# EAGLE design enginecontrol (EAGLE 7.6.0)
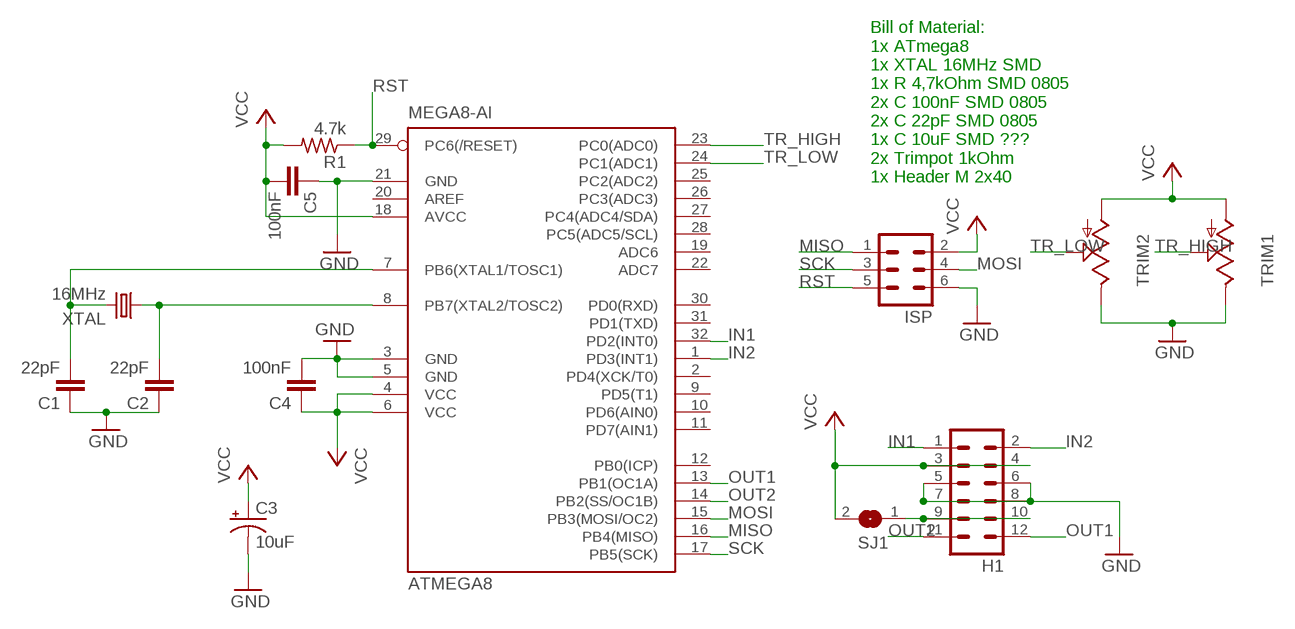
[diagram p0: schematic, sheet 1]

## Parts
ATMEGA8  MEGA8-AI  [TQFP32-08]
C1  22pF  C-EUC0805  [C0805]
C2  22pF  C-EUC0805  [C0805]
C3  10uF  CPOL-US153CLV-0605  [153CLV-0605]
C4  100nF  C-EUC0805  [C0805]
C5  100nF  C-EUC0805  [C0805]
H1  MA06-2  [MA06-2]
ISP  MA03-2  [MA03-2]
R1  4.7k  R-US_M0805  [M0805]
SJ1  SJ  [SJ]
TRIM1  TRIM_US-B25P  [B25P]
TRIM2  TRIM_US-B25P  [B25P]
XTAL  16MHz  CRYSTALSM49  [SM49]

## Nets
GND: ATMEGA8.3(GND) ATMEGA8.5(GND) ATMEGA8.21(GND) C1.1 C2.1 C3.- C4.2 C5.1 H1.5 H1.6 H1.7 H1.8 ISP.6 TRIM1.E TRIM2.E
IN1: ATMEGA8.32(PD2(INT0)) H1.1
IN2: ATMEGA8.1(PD3(INT1)) H1.2
MISO: ATMEGA8.16(PB4(MISO)) ISP.1
MOSI: ATMEGA8.15(PB3(MOSI/OC2)) ISP.4
N$1: ATMEGA8.8(PB7(XTAL2/TOSC2)) C2.2 XTAL.1
N$2: ATMEGA8.7(PB6(XTAL1/TOSC1)) C1.2 XTAL.2
N$7: H1.9 H1.10 SJ1.1
OUT1: ATMEGA8.13(PB1(OC1A)) H1.12
OUT2: ATMEGA8.14(PB2(SS/OC1B)) H1.11
RST: ATMEGA8.29(PC6(/RESET)) ISP.5 R1.1
SCK: ATMEGA8.17(PB5(SCK)) ISP.3
TR_HIGH: ATMEGA8.23(PC0(ADC0)) TRIM1.S
TR_LOW: ATMEGA8.24(PC1(ADC1)) TRIM2.S
VCC: ATMEGA8.4(VCC) ATMEGA8.6(VCC) ATMEGA8.18(AVCC) C3.+ C4.1 C5.2 H1.3 H1.4 ISP.2 R1.2 SJ1.2 TRIM1.A TRIM2.A
Unconnected: ATMEGA8.2(PD4(XCK/T0)) ATMEGA8.9(PD5(T1)) ATMEGA8.10(PD6(AIN0)) ATMEGA8.11(PD7(AIN1)) ATMEGA8.12(PB0(ICP)) ATMEGA8.19(ADC6) ATMEGA8.20(AREF) ATMEGA8.22(ADC7) ATMEGA8.25(PC2(ADC2)) ATMEGA8.26(PC3(ADC3)) ATMEGA8.27(PC4(ADC4/SDA)) ATMEGA8.28(PC5(ADC5/SCL)) ATMEGA8.30(PD0(RXD)) ATMEGA8.31(PD1(TXD))

## Notes on the sheet
- Bill of Material:
  1x ATmega8
  1x XTAL 16MHz SMD
  1x R 4,7kOhm SMD 0805
  2x C 100nF SMD 0805
  2x C 22pF SMD 0805
  1x C 10uF SMD ???
  2x Trimpot 1kOhm
  1x Header M 2x40

## Library data of the parts
ATMEGA8 = atmel:MEGA8: MICROCONTROLLER 8 Kbytes FLASH, 1 kbytes SRAM, 512 bytes EEPROM, USART, 6-channel 10 bit ADC, 2-channel 8 bit ADC Pin compatible with Atmega48, ATMega88, ATMega168 Source: avr.lbr; MPN: ATMEGA8-16AU; OC_FARNELL: 9171371; OC_NEWARK: 73M8863
C1 C2 C4 C5 = rcl:C-EU: CAPACITOR, European symbol
C3 = rcl:CPOL-US: POLARIZED CAPACITOR, American symbol
H1 = con-lstb:MA06-2: PIN HEADER; OC_FARNELL: unknown; OC_NEWARK: unknown
ISP = con-lstb:MA03-2: PIN HEADER; OC_FARNELL: unknown; OC_NEWARK: unknown
R1 = resistor:R-US_: RESISTOR, American symbol
SJ1 = jumper:SJ: SMD solder JUMPER
TRIM1 TRIM2 = pot:TRIM_US-: POTENTIOMETER
XTAL = adafruit:CRYSTAL: CRYSTAL; OC_FARNELL: unknown; OC_NEWARK: unknown

## Board
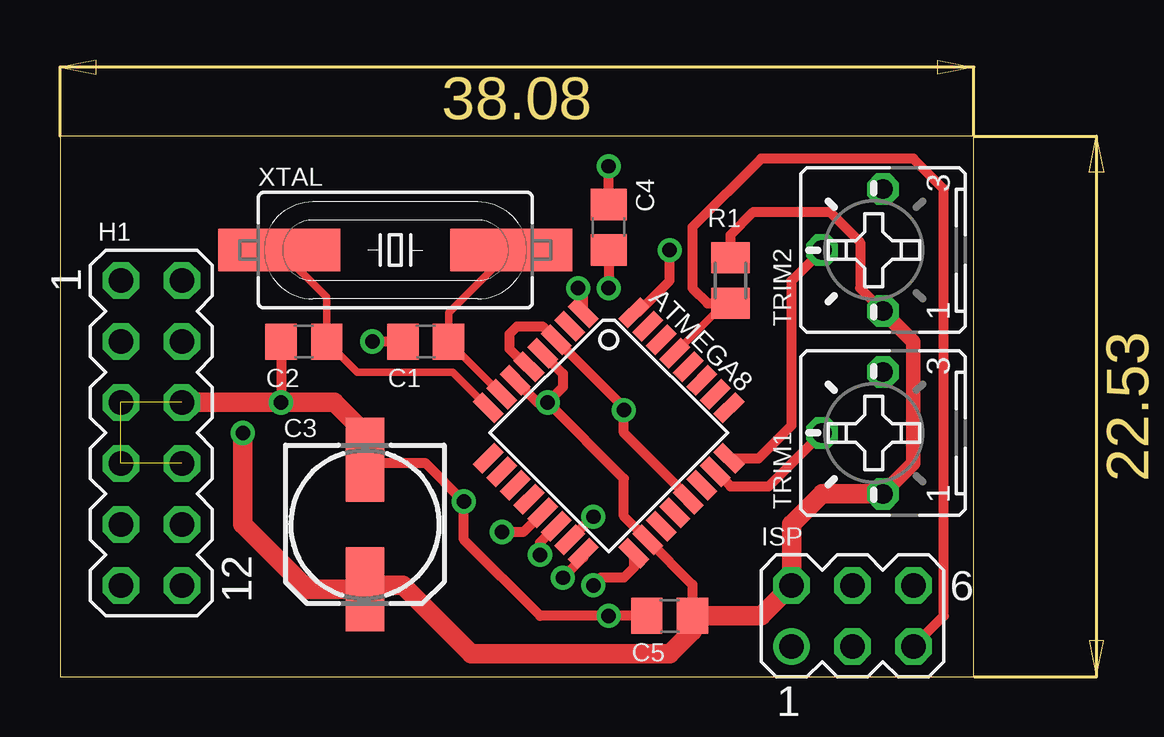
[diagram p1: board, top side]
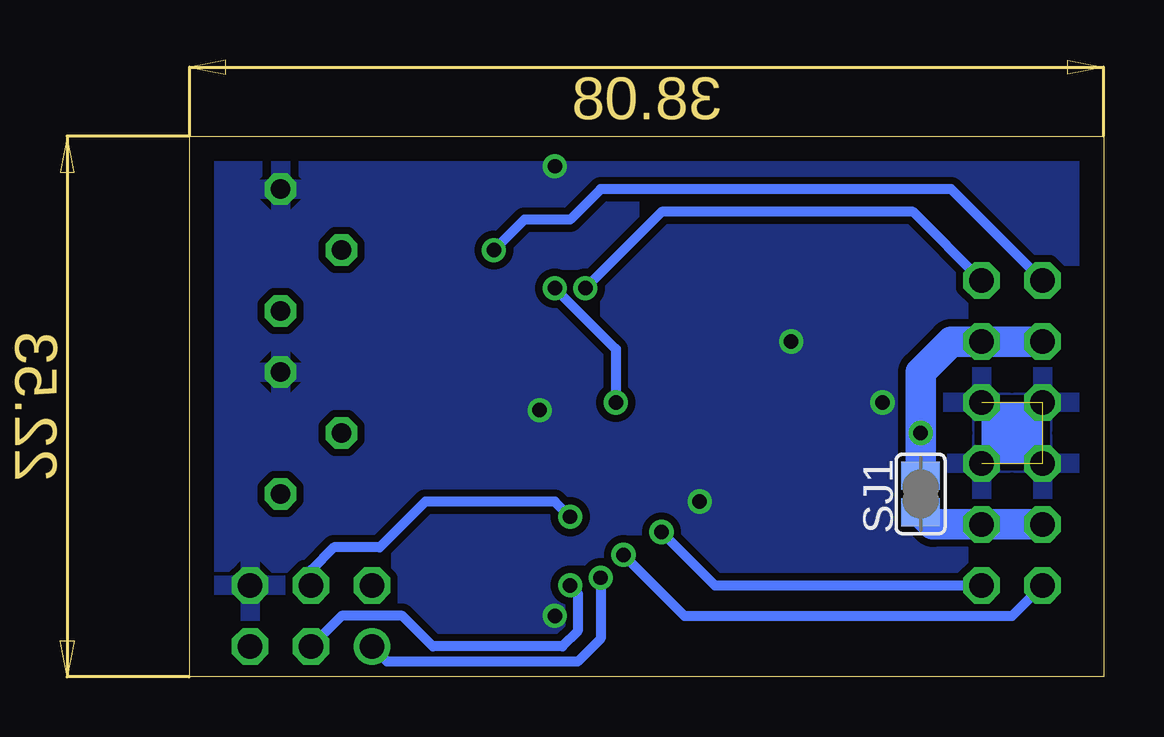
[diagram p2: board, bottom side, seen from below]

Size 38.08 x 22.53 mm. Coordinates in mm from the lower left corner, seen from the top.
Outline: 0,0 38.08,0 38.08,22.53 0,22.53 0,0
Copper layers (1*16): Top 0.035mm / dielectric 1.5mm / Bottom 0.035mm
Design rules "default": minimum track width 10mil, minimum drill 24mil, track to track 8mil, track to pad 8mil, pad to pad 8mil, via to via 8mil, smd to smd 8mil, copper to edge 40mil, drill to drill 8mil, minimum pad ring 10mil, minimum via ring 8mil, stop-mask expansion 4mil, vias tented up to drill 0mil, thermal gap 10mil

### Footprints (pad centres in the part's own frame; a part is rotated, then mirrored left to right if it is on the bottom)
TQFP32-08 = smd 1.27 x 0.559: 1 -4.293,2.8; 2 -4.293,2; 3 -4.293,1.2; 4 -4.293,0.4; 5 -4.293,-0.4; 6 -4.293,-1.2; 7 -4.293,-2; 8 -4.293,-2.8; 17 4.293,-2.8; 18 4.293,-2; 19 4.293,-1.2; 20 4.293,-0.4; 21 4.293,0.4; 22 4.293,1.2; 23 4.293,2; 24 4.293,2.8 | smd 0.559 x 1.27: 9 -2.8,-4.293; 10 -2,-4.293; 11 -1.2,-4.293; 12 -0.4,-4.293; 13 0.4,-4.293; 14 1.2,-4.293; 15 2,-4.293; 16 2.8,-4.293; 25 2.8,4.293; 26 2,4.293; 27 1.2,4.293; 28 0.4,4.293; 29 -0.4,4.293; 30 -1.2,4.293; 31 -2,4.293; 32 -2.8,4.293
C0805 = smd 1.3 x 1.5: 1 -0.95,0; 2 0.95,0
153CLV-0605 = smd 3.5 x 1.6: + 2.7,0; - -2.7,0
MA06-2 = drill 1.016 octagon: 1 -6.35,-1.27; 2 -6.35,1.27; 3 -3.81,-1.27; 4 -3.81,1.27; 5 -1.27,-1.27; 6 -1.27,1.27; 7 1.27,-1.27; 8 1.27,1.27; 9 3.81,-1.27; 10 3.81,1.27; 11 6.35,-1.27; 12 6.35,1.27
MA03-2 = drill 1.016: 1 -2.54,-1.27 | drill 1.016 octagon: 2 -2.54,1.27; 3 0,-1.27; 4 0,1.27; 5 2.54,-1.27; 6 2.54,1.27
M0805 = smd 1.3 x 1.6: 1 -0.95,0; 2 0.95,0
SJ = smd 1.168 x 1.6: 1 -0.762,0; 2 0.762,0
B25P = drill 0.813 octagon: A -2.54,0; E 2.54,0; S 0,2.54
SM49 = smd 5.08 x 1.778: 1 -4.826,0; 2 4.826,0

### Placement (x,y rotation side)
ATMEGA8  22.86,10.16 315 top
C1  15.24,13.97 0 top
C2  10.16,13.97 0 top
C3  12.7,6.35 270 top
C4  22.86,18.73 90 top
C5  25.4,2.54 0 top
H1  3.81,10.16 270 top
ISP  33.02,2.54 0 top
R1  27.94,16.51 90 top
SJ1  7.62,7.62 90 bottom
TRIM1  34.29,10.16 90 top
TRIM2  34.29,17.78 90 top
XTAL  13.97,17.78 0 top

### Tracks (layer width: path | path; a pad name or v marks a point on that pad's centre or on a via)
GND  (via drill 0.6)  (3 unrouted)
  Top 0.406: ATMEGA8.21 26.18,7.48 23.5,10.16 v23.5,11.11 23.5,11.22 ATMEGA8.3 20.11,14.61 19.05,14.61 18.73,14.29 18.73,13.65 19.47,12.91 ATMEGA8.5 | C1.1 v13.02,13.97 | C2.1 9.21,11.75 8.89,11.43 | C5.1 v22.86,2.54 20,2.54 16.83,5.71 v16.83,7.3 15.24,8.89 12.86,8.89 C3.- | C4.2 v22.86,21.27
  Top 0.813: C3.- 12.7,10.16 11.43,11.43 v9.21,11.43 8.89,11.43 H1.6
  pour Bottom (isolate 0.305): 0,22.86 38.1,22.86 38.1,0 0,0
IN1  (via drill 0.6)
  Top 0.406: ATMEGA8.32 24.07,15.18 25.4,16.51 v25.4,17.78
  Bottom 0.406: H1.1 6.35,20.32 20.95,20.32 22.23,19.05 24.13,19.05 v25.4,17.78
IN2  (via drill 0.6)
  Top 0.406: ATMEGA8.1 21.8,15.98 v21.59,16.19
  Bottom 0.406: H1.2 7.94,19.37 18.41,19.37 v21.59,16.19
MISO  (via drill 0.6)
  Top 0.406: ATMEGA8.16 21.8,4.98 v20.95,4.13
  Bottom 0.406: v20.95,4.13 20.95,1.59 21.91,0.64 29.84,0.64 ISP.1
MOSI  (via drill 0.6)
  Top 0.406: ATMEGA8.15 22.2,6.67 v22.23,6.67
  Bottom 0.406: v22.23,6.67 22.86,7.3 28.26,7.3 30.16,5.4 32.07,5.4 33.02,4.45 ISP.4
N$1
  Top 0.305: XTAL.1 11.11,15.81 C2.2 12.38,12.7 16.36,12.7 ATMEGA8.8
N$2
  Top 0.305: ATMEGA8.7 18.38,11.78 C1.2 16.19,15.17 XTAL.2
N$7
  Bottom 1.27: H1.9 H1.10 7.11,6.35 SJ1.1
OUT1  (via drill 0.6)
  Top 0.406: ATMEGA8.13 19.3,6.03 v18.41,6.03
  Bottom 0.406: v18.41,6.03 16.19,3.81 H1.12
OUT2  (via drill 0.6)
  Top 0.406: ATMEGA8.14 20,5.61 v20,5.08
  Bottom 0.406: v20,5.08 17.46,2.54 3.81,2.54 H1.11
RST
  Top 0.305: ATMEGA8.29 27.69,15.56 R1.1
  Top 0.406: ISP.5 36.83,2.54 36.83,20.32 35.56,21.59 29.21,21.59 26.35,18.73 26.35,16.19 26.98,15.56 R1.1
SCK  (via drill 0.6)
  Top 0.406: ATMEGA8.17 23.91,4.55 23.5,4.13 22.54,4.13 v22.23,3.81
  Bottom 0.406: v22.23,3.81 21.91,3.49 21.91,1.91 22.54,1.27 27.94,1.27 29.21,2.54 31.75,2.54 ISP.3
TR_HIGH
  Top 0.406: ATMEGA8.23 27.34,8.54 27.94,7.94 29.53,7.94 TRIM1.S
TR_LOW
  Top 0.406: ATMEGA8.24 29.11,9.11 30.48,10.48 30.48,16.51 TRIM2.S
VCC  (via drill 0.6)
  Top 0.406: ATMEGA8.6 19.89,11.43 v20.32,11.43 | ATMEGA8.4 20.95,12.63 20.95,12.06 v20.32,11.43 | v20.32,11.43 23.5,8.26 23.5,6.7 ATMEGA8.18 26.35,3.84 C5.2 | 30.45,3.84 ISP.2 | R1.2 27.94,18.41 28.89,19.37 32.07,19.37 33.34,18.1 33.34,16.19 TRIM2.A | C4.1 v22.86,16.19
  Top 0.61: TRIM1.A 35.56,8.89 35.56,13.97 TRIM2.A
  Top 0.813: v7.62,10.16 7.62,6.35 10.32,3.65 C3.+ 12.7,3.81 14.29,3.81 17.14,0.95 25.4,0.95 26.35,1.91 C5.2 29.21,2.54 30.45,3.78 30.45,3.84 | ISP.2 30.48,6.35 31.75,7.62 TRIM1.A
  Bottom 0.406: v22.86,16.19 20.32,13.65 v20.32,11.43
  Bottom 1.27: SJ1.2 v7.62,10.16 7.62,12.7 6.35,13.97 H1.4 H1.3
(copper drawn outside any net)
  shapes: Bottom area x1

### Text on the board
tNames: Matikan tValues dan bValues